# EasyEDA Pro project ProPrj_Microros_esp32_2025-06-17.epro, board PCB_V2.1
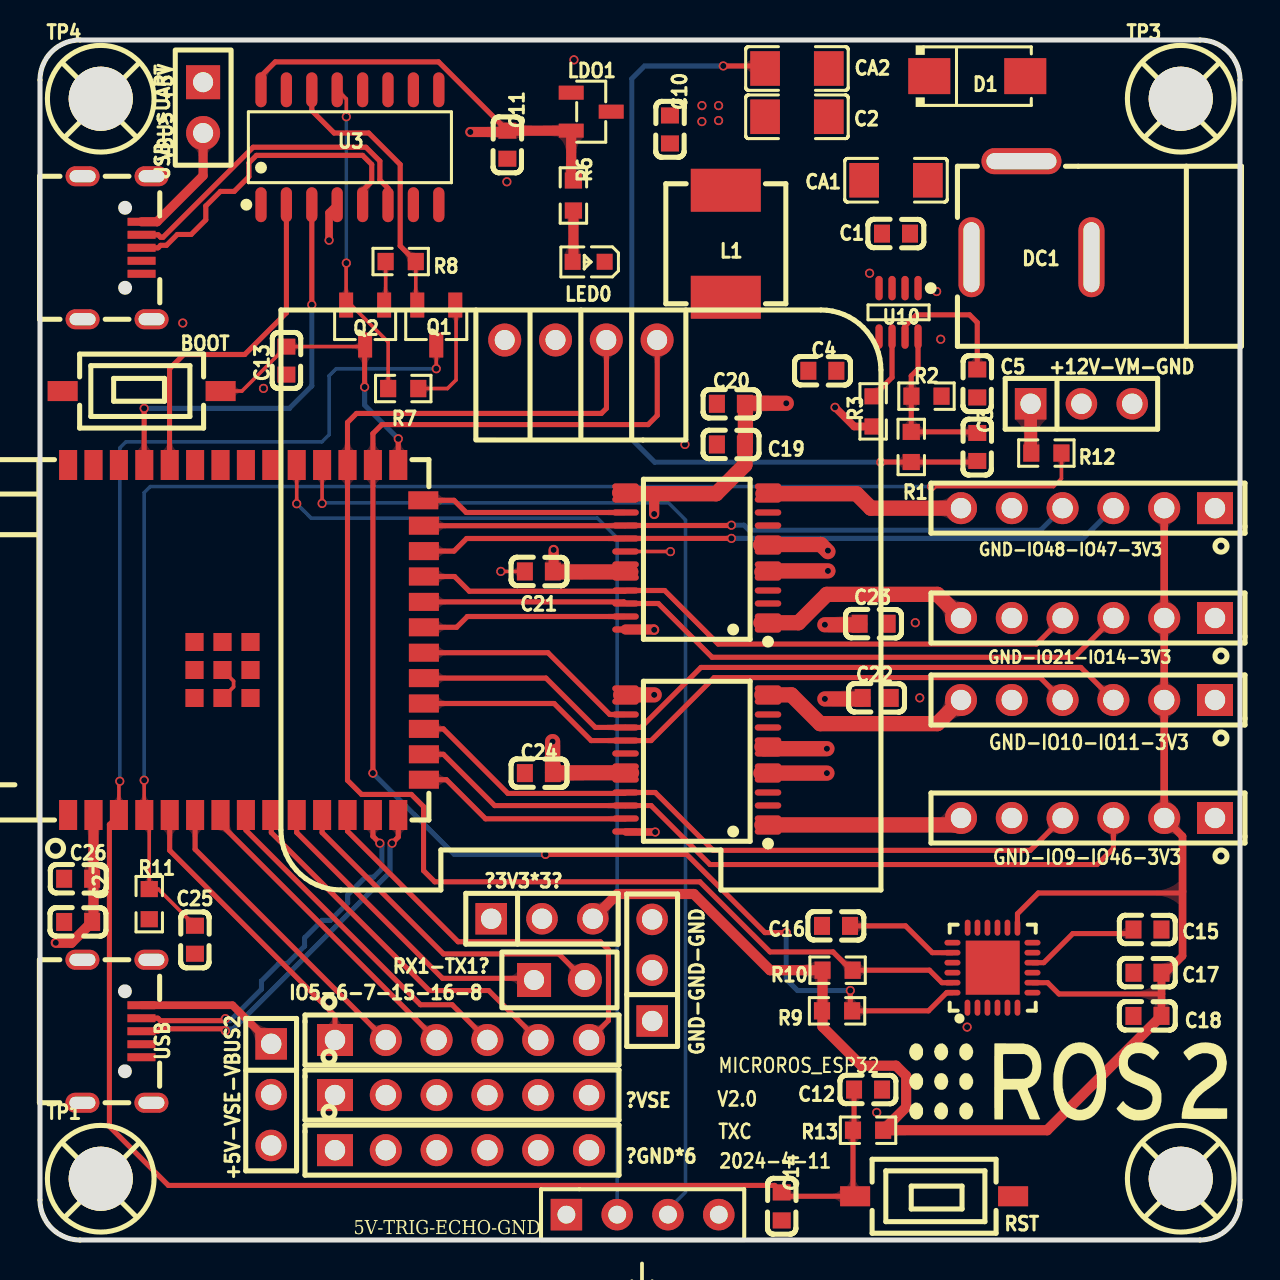
[diagram p10: board, top side]
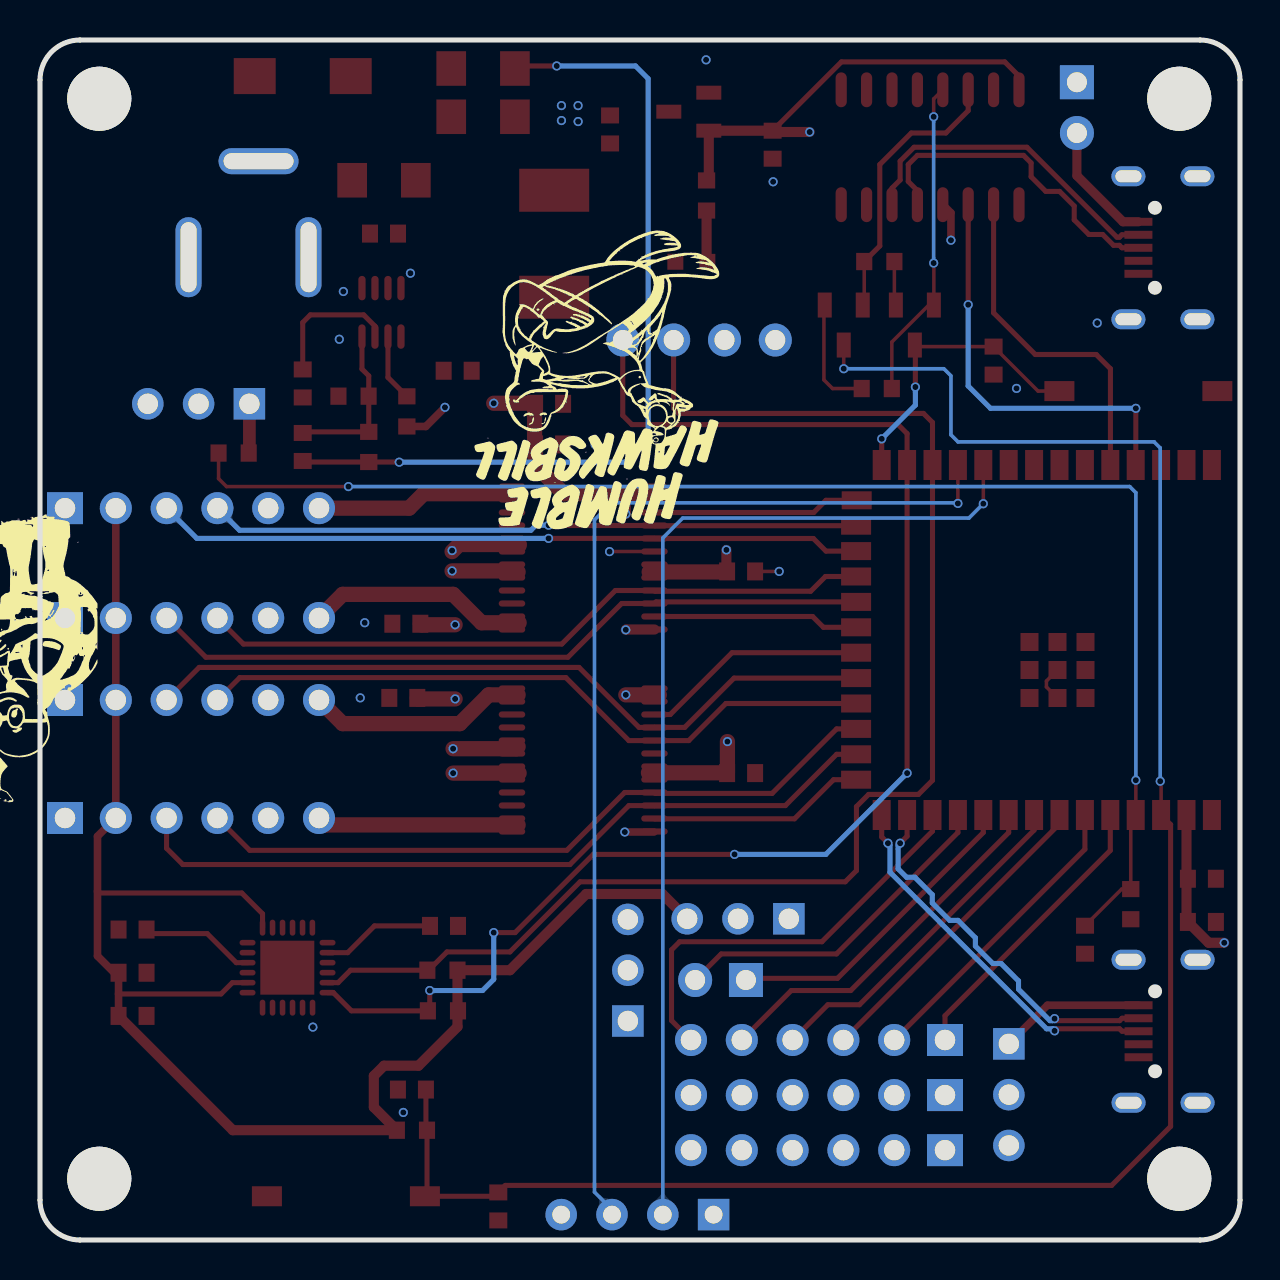
[diagram p11: board, bottom side, seen from below]

Outline 60 x 60 mm; copper layers: Top Layer, GND, POWER, Bottom Layer. Coordinates in mm from the lower left corner of the outline.
Outline path: 0,58 0,2 arc(0.59,0.59) 2,0 58,0 arc(59.41,0.59) 60,2 60,58 arc(59.41,59.41) 58,60 2,60 arc(0.59,59.41) 0,58
Stack: Top Layer 0.035mm 外层铜厚1oz / Dielectric1 0.2104mm 7628 RC49% 8.6mil / GND 0.0152mm 内层铜厚 / Dielectric2 1.065mm 1.1mm H/HOZ 含铜 / POWER 0.0152mm 内层铜厚 / Dielectric3 0.2104mm 7628 RC49% 8.6mil / Bottom Layer 0.035mm 外层铜厚1oz

## Design rules (mm)
net GPIO_19: DP2
net GPIO_20: DP2
net USB_DP: DP1
net USB_DN: DP1
template: 自定义配置
spacing copperThickness1oz (default): track to track 0.102, other pairs 0 to 0.3
spacing copperThickness2oz: track to track 0.203, other pairs 0.152 to 0.3
track width copperThickness1oz (default): min 0.127, default 0.178, max 2.54
track width copperThickness2oz: min 0.203, default 0.254, max 2.54
differential pair differentialPair (default): width min 0.254, default 0.254, max 0.254; gap min 0.152, default 0.152
via viaSize (default): diameter min 0.254, default 0.457, max 10; hole min 0.3, default 0.305, max 6.299

## Placement (name value [footprint] x y rotation side)
5V-TRIG-ECHO-GND  -  [HC-SR04]  30.1 1.24 0 top
+5V-VSE-VBUS2  -  [HDR-TH_3P-P2.54-V-F]  11.56 7.27 270 top
+12V-VM-GND  -  [HDR-TH_3P-P2.54-V-F]  52.07 41.81 0 top
BOOT  -  [Key_SMD_3.6x6.1x2.5]  5.08 42.45 0 top
C1  0.1uf  [C0603]  42.8 50.32 0 top
C2  22uf  [C1206]  37.85 56.16 180 top
C3  33PF  [C0603]  46.86 39.65 90 top
C4  0.1uf  [C0603]  39.12 43.46 180 top
C5  0.1uf  [C0603]  46.86 42.83 90 top
C10  1uf  [C0603]  31.5 55.53 270 top
C11  1uf  [C0603]  23.37 54.77 90 top
C12  1uf  [C0603]  41.4 7.52 0 top
C13  0.1uf  [C0603]  12.32 43.97 270 top
C14  0.1uf  [C0603]  37.09 1.68 270 top
C15  0.1uf  [C0603]  55.37 15.52 0 top
C16  2.2uf  [C0603]  39.8 15.7 0 top
C17  10nf  [C0603]  55.37 13.36 0 top
C18  0.1uf  [C0603]  55.37 11.2 0 top
C19  10uf  [C0603]  34.54 39.78 180 top
C20  0.1uf  [C0603]  34.54 41.81 180 top
C21  0.1uf  [C0603]  24.94 33.43 180 top
C22  10uf  [C0603]  41.84 27.1 0 top
C23  0.1uf  [C0603]  41.68 30.81 0 top
C24  0.1uf  [C0603]  24.94 23.34 180 top
C25  0.1uf  [C0603]  7.75 15.01 90 top
C26  22uF  [C0603]  1.91 18.06 180 top
C27  100nF  [C0603]  1.91 15.9 0 top
CA1  22uf  [C1206]  42.8 52.99 0 top
CA2  22uf  [C1206]  37.85 58.58 0 top
D1  SMAJ12A  [SMA_L4.3-W2.8-LS5.1-RD]  46.86 58.19 0 top
DC1  -  [DC-2.0]  49.7 48.87 0 top
GND-GND-GND  -  [HDR-TH_3P-P2.54-V-F]  30.61 13.49 90 top
GND-IO21-IO14-3V3  -  [HDR-TH_6P-P2.54-V-F]  52.4 31.1 180 top
GND-IO48-IO47-3V3  -  [HDR-TH_6P-P2.54-V-F]  52.4 36.59 180 top
H4  -  [HDR-TH_6P-P2.54-V-F]  52.4 21.1 180 top
H5  -  [HDR-TH_6P-P2.54-V-F]  52.4 27 180 top
IO5-6-7-15-16-8  -  [HDR-TH_6P-P2.54-V-F]  21.1 10 0 top
L1  4.7uH  [IND-SMD_L6.5-W6.0_GPSR0630]  34.29 49.81 90 top
LDO1  SC662K-3.3V  [SOT-23-3_L2.9-W1.3-P1.90-LS2.4-BR]  27.56 56.42 180 top
LED0  -  [LED_0603]  27.38 48.9 180 top
OLED1  0.96OLED_4P_MODULE_JX  [0.96OLED_4P]  27.05 45 0 top
Q1  L8050QLT1G  [SOT-23-3_L2.9-W1.3-P1.90-LS2.4-BR]  19.81 45.75 90 top
Q2  L8050QLT1G  [SOT-23-3_L2.9-W1.3-P1.90-LS2.4-BR]  16.26 45.75 90 top
R1  -  [R0603]  43.56 39.65 90 top
R2  -  [R0603]  44.32 42.19 0 top
R3  -  [R0603]  41.66 41.43 90 top
R6  -  [R0603]  26.67 52.22 270 top
R7  -  [R0603]  18.16 42.57 0 top
R8  -  [R0603]  18.03 48.92 180 top
R9  -  [R0603]  39.85 11.46 180 top
R10  -  [R0603]  39.88 13.49 180 top
R11  -  [R0603]  5.46 16.79 90 top
R12  -  [R0603]  50.32 39.35 180 top
R13  10kΩ  [R0603]  41.4 5.49 0 top
RST  -  [Key_SMD_3.6x6.1x2.5]  44.7 2.19 180 top
RX1-TX1👉  -  [HDR-TH_2P-P2.54-V-F]  25.97 13 0 top
TP1  -  [M3螺丝]  3.1 3 0 top
TP2  -  [M3螺丝]  57.1 3 0 top
TP3  -  [M3螺丝]  57.1 57 0 top
TP4  -  [M3螺丝]  3.1 57 0 top
U1  ESP32-S3-WROOM-1-N16R2  [WIRELM-SMD_ESP32-S3-WROOM-1]  10.3 30 90 top
U3  CH340C  [SOP-16_L10.0-W3.9-P1.27-LS6.0-BL]  15.5 54.64 0 top
U6  MPU-6050  [QFN-24_L4.0-W4.0-P0.50-BL-EP2.7]  47.62 13.62 0 top
U7  TB6612FNG,C,8,EL  [SSOP-24_L8.3-W5.6-P0.65-LS7.6-BL]  32.84 34.1 90 top
U8  TB6612FNG,C,8,EL  [SSOP-24_L8.3-W5.6-P0.65-LS7.6-BL]  32.84 24 90 top
U10  MP2225GJ-Z  [TSOT-23-8_L2.9-W1.6-P0.65-LS2.8-BR]  42.93 46.38 90 top
USB  -  [USB_Micro]  3.85 10.44 270 top
USB->UART  -  [USB_Micro]  3.85 49.61 270 top
VBUS +5V  -  [HDR-TH_2P-P2.54-V-F]  8.15 56.62 270 top
👇3V3*3👇  -  [HDR-TH_3P-P2.54-V-F]  25.1 16.06 0 top
👈GND*6  -  [HDR-TH_6P-P2.54-V-F]  21.1 4.49 0 top
👈VSE  -  [HDR-TH_6P-P2.54-V-F]  21.1 7.25 0 top

## Footprints (pads in the part's own frame, mm; a bottom-side part is the same pattern mirrored in y, then rotated)
0.96OLED_4P
  round 1.65 hole 1: 1(-3.81,-0.002) 2(-1.27,0.002) 3(1.27,0.002) 4(3.81,0.002)
C0603
  rect 0.8x0.9 smd: 1(-0.7,0) 2(0.7,0)
C1206
  rect 1.485x1.728 smd: 1(-1.593,0) 2(1.593,0)
DC-2.0
  oval 4x1.3 hole 3.5x0.8: 2(-0.627,5.067)
  oval 1.3x4 hole 0.8x3.5: 3(2.873,0.267) 4(-3.127,0.267)
HC-SR04
  rect 1.575x1.575 hole 0.889: 1(-3.78,0.03)
  round 1.575 hole 0.889: 2(-1.24,0.03) 3(1.3,0.03) 4(3.84,0.03)
HDR-TH_2P-P2.54-V-F
  rect 1.7x1.7 hole 1: 1(-1.27,0)
  round 1.7 hole 1: 2(1.27,0)
HDR-TH_3P-P2.54-V-F
  rect 1.575x1.575 hole 1.02: 1(-2.54,0)
  round 1.575 hole 1.02: 2(0,0) 3(2.54,0)
HDR-TH_6P-P2.54-V-F
  rect 1.8x1.6 hole 1.02: 1(-6.35,0)
  round 1.6 hole 1.02: 2(-3.81,0) 3(-1.27,0) 4(1.27,0) 5(3.81,0) 6(6.35,0)
IND-SMD_L6.5-W6.0_GPSR0630
  rect 2.15x3.5 smd: 1(-2.675,0) 2(2.675,0)
Key_SMD_3.6x6.1x2.5
  rect 1.501x1.001 smd: 1(-3.95,0) 2(3.95,0)
LED_0603
  rect 0.8x0.8 smd: 1(-0.851,-0.01) 2(0.75,-0.005)
M3螺丝
  round 3.2 hole 3.2: 1(-0.064,0.064)
QFN-24_L4.0-W4.0-P0.50-BL-EP2.7
  oval 0.28x0.8 smd: 1(-1.25,-2) 2(-0.75,-2) 3(-0.25,-2) 4(0.25,-2) 5(0.75,-2) 6(1.25,-2) 13(1.25,2) 14(0.75,2) 15(0.25,2) 16(-0.25,2) 17(-0.75,2) 18(-1.242,2)
  oval 0.8x0.28 smd: 7(2,-1.25) 8(2,-0.75) 9(2,-0.25) 10(2,0.25) 11(2,0.75) 12(2,1.25) 19(-2,1.25) 20(-2,0.75) 21(-2,0.25) 22(-2,-0.25) 23(-2,-0.75) 24(-2,-1.25)
  rect 2.7x2.7 smd: 25(0.013,0)
R0603
  rect 0.806x0.864 smd: 1(-0.753,0) 2(0.753,0)
SMA_L4.3-W2.8-LS5.1-RD
  rect 2.1x1.8 smd: 1(-2.4,0) 2(2.4,0)
SOP-16_L10.0-W3.9-P1.27-LS6.0-BL
  oval 0.56x1.745 smd: 1(-4.445,-2.873) 2(-3.175,-2.873) 3(-1.905,-2.873) 4(-0.635,-2.873) 5(0.635,-2.873) 6(1.905,-2.873) 7(3.175,-2.873) 8(4.445,-2.873) 9(4.445,2.873) 10(3.175,2.873) 11(1.905,2.873) 12(0.635,2.873) 13(-0.635,2.873) 14(-1.905,2.873) 15(-3.175,2.873) 16(-4.445,2.873)
SOT-23-3_L2.9-W1.3-P1.90-LS2.4-BR
  rect 1.25x0.7 smd: 1(1,-0.95) 2(1,0.95) 3(-1,0)
SSOP-24_L8.3-W5.6-P0.65-LS7.6-BL
  oval 0.308x1.324 smd: 1(-3.575,-3.562) 2(-2.925,-3.562) 3(-2.275,-3.562) 4(-1.625,-3.562) 5(-0.975,-3.562) 6(-0.325,-3.562) 7(0.325,-3.562) 8(0.975,-3.562) 9(1.625,-3.562) 10(2.275,-3.562) 11(2.925,-3.562) 12(3.575,-3.562) 13(3.575,3.562) 14(2.925,3.562) 15(2.275,3.562) 16(1.625,3.562) 17(0.975,3.562) 18(0.325,3.562) 19(-0.325,3.562) 20(-0.975,3.562) 21(-1.625,3.562) 22(-2.275,3.562) 23(-2.925,3.562) 24(-3.575,3.562)
TSOT-23-8_L2.9-W1.6-P0.65-LS2.8-BR
  oval 1.222x0.364 smd: 1(1.211,-0.975) 2(1.211,-0.325) 3(1.211,0.325) 4(1.211,0.975) 5(-1.211,0.975) 6(-1.211,0.325) 7(-1.211,-0.325) 8(-1.211,-0.975)
USB_Micro
  rect 0.4x1.4 smd: 1(-1.3,1.225) 2(-0.65,1.225) 3(0,1.225) 4(0.65,1.225) 5(1.3,1.225)
  oval 1x1.7 hole 0.6x1.3: 6(-3.575,1.725) 6(-3.575,-1.725) 6(3.575,1.725) 6(3.575,-1.725)
WIRELM-SMD_ESP32-S3-WROOM-1
  rect 1.5x0.9 smd: 1(-8.75,8.895) 2(-8.75,7.625) 3(-8.75,6.355) 4(-8.75,5.085) 5(-8.75,3.815) 6(-8.75,2.545) 7(-8.75,1.275) 8(-8.75,0.005) 9(-8.75,-1.265) 10(-8.75,-2.535) 11(-8.75,-3.805) 12(-8.75,-5.075) 13(-8.75,-6.345) 14(-8.75,-7.615) 27(8.75,-7.615) 28(8.75,-6.345) 29(8.75,-5.075) 30(8.75,-3.805) 31(8.75,-2.535) 32(8.75,-1.265) 33(8.75,0.005) 34(8.75,1.275) 35(8.75,2.545) 36(8.75,3.815) 37(8.75,5.085) 38(8.75,6.355) 39(8.75,7.625) 40(8.75,8.895)
  rect 0.9x1.5 smd: 15(-6.985,-8.895) 16(-5.715,-8.895) 17(-4.445,-8.895) 18(-3.175,-8.895) 19(-1.905,-8.895) 20(-0.635,-8.895) 21(0.635,-8.895) 22(1.905,-8.895) 23(3.175,-8.895) 24(4.445,-8.895) 25(5.715,-8.895) 26(6.985,-8.865)
  rect 0.9x0.9 smd: 41(-2.9,2.575) 41(-2.9,1.175) 41(-2.9,-0.225) 41(-1.5,2.575) 41(-1.5,1.175) 41(-1.5,-0.225) 41(-0.1,2.575) 41(-0.1,1.175) 41(-0.1,-0.225)

## Nets
+5V: 5V-TRIG-ECHO-GND.1 +5V-VSE-VBUS2.3 C2.2 C3.1 C10.1 C21.1 C24.1 CA2.1 L1.2 LDO1.3 OLED1.2 R1.1 U7.19 U7.20 U8.19 U8.20 VBUS +5V.1
+12V: +12V-VM-GND.1 C1.2 CA1.2 D1.1 DC1.4 R3.1 R12.2 U10.2
GND: 5V-TRIG-ECHO-GND.4 +12V-VM-GND.3 BOOT.1 C1.1 C2.1 C5.1 C10.2 C11.1 C12.2 C13.2 C14.2 C15.2 C16.1 C17.1 C18.1 C19.2 C20.2 C21.2 C22.2 C23.2 C24.2 C25.1 C26.2 C27.1 CA1.1 CA2.2 D1.2 DC1.2 DC1.3 GND-GND-GND.1 GND-GND-GND.2 GND-GND-GND.3 GND-IO21-IO14-3V3.5 GND-IO48-IO47-3V3.5 H4.5 H5.5 LDO1.1 LED0.1 OLED1.1 R2.2 R11.1 RST.1 U1.1 U1.40 U1.41 U3.1 U6.1 U6.9 U6.11 U6.18 U6.25 U7.3 U7.4 U7.9 U7.10 U7.18 U8.3 U8.4 U8.9 U8.10 U8.18 U10.1 U10.4 USB.5 USB.6 USB->UART.5 USB->UART.6 👈GND*6.1 👈GND*6.2 👈GND*6.3 👈GND*6.4 👈GND*6.5 👈GND*6.6
VBUS1: USB->UART.1 VBUS +5V.2
VBUS2: +5V-VSE-VBUS2.1 USB.1
VCC_3V3: C11.2 C17.2 C18.2 C26.1 C27.2 GND-IO21-IO14-3V3.2 GND-IO48-IO47-3V3.2 H4.2 H5.2 LDO1.2 R6.1 R9.2 R10.2 R13.2 U1.2 U3.4 U3.16 U6.8 U6.13 👇3V3*3👇.1 👇3V3*3👇.2 👇3V3*3👇.3
ADC: C25.2 R11.2 R12.1 U1.4
DTR: Q2.2 R7.1 U3.13
ECHO: 5V-TRIG-ECHO-GND.3 U1.30
ESP_RST: C12.1 C14.1 Q1.3 R13.1 RST.2 U1.3
ESP_RX: U1.36 U3.2
ESP_TX: U1.37 U3.3
GPIO_0: BOOT.2 C13.1 Q2.3 U1.27
GPIO_3: U1.15 U8.23
GPIO_5: IO5-6-7-15-16-8.1 U1.5
GPIO_6: IO5-6-7-15-16-8.2 U1.6
GPIO_7: IO5-6-7-15-16-8.3 U1.7
GPIO_8: IO5-6-7-15-16-8.6 U1.12
GPIO_9: H4.4 U1.17 U8.21
GPIO_10: H5.4 U1.18 U8.17
GPIO_11: H5.3 U1.19 U8.16
GPIO_12: U1.20 U8.15
GPIO_13: U1.21 U7.23
GPIO_14: GND-IO21-IO14-3V3.3 U1.22 U7.22
GPIO_15: IO5-6-7-15-16-8.4 U1.8
GPIO_16: IO5-6-7-15-16-8.5 U1.9
GPIO_19: U1.13 USB.2
GPIO_20: U1.14 USB.3
GPIO_21: GND-IO21-IO14-3V3.4 U1.23 U7.21
GPIO_35: OLED1.4 R9.1 U1.28 U6.24
GPIO_36: OLED1.3 R10.1 U1.29 U6.23
GPIO_38: 5V-TRIG-ECHO-GND.2 U1.31
GPIO_45: U1.26 U7.15
GPIO_46: H4.3 U1.16 U8.22
GPIO_47: GND-IO48-IO47-3V3.3 U1.24 U7.17
GPIO_48: GND-IO48-IO47-3V3.4 U1.25 U7.16
M1_AO1: GND-IO21-IO14-3V3.6 U7.1 U7.2
M1_AO2: GND-IO21-IO14-3V3.1 U7.5 U7.6
M1_BO1: GND-IO48-IO47-3V3.6 U7.11 U7.12
M1_BO2: GND-IO48-IO47-3V3.1 U7.7 U7.8
M2_AO1: H4.6 U8.1 U8.2
M2_AO2: H4.1 U8.5 U8.6
M2_BO1: H5.6 U8.11 U8.12
M2_BO2: H5.1 U8.7 U8.8
RTS: Q1.2 R8.1 U3.14
RX1: RX1-TX1👉.1 U1.10
TX1: RX1-TX1👉.2 U1.11
USB_DN: U3.6 USB->UART.2
USB_DP: U3.5 USB->UART.3
VMOTOR: +12V-VM-GND.2 C19.1 C20.1 C22.1 C23.1 U7.13 U7.14 U7.24 U8.13 U8.14 U8.24
VSERVO: +5V-VSE-VBUS2.2 👈VSE.1 👈VSE.2 👈VSE.3 👈VSE.4 👈VSE.5 👈VSE.6
$1N8417: LED0.2 R6.2
$1N8423: Q1.1 R7.2
$1N8428: Q2.1 R8.2
$1N8498: C15.1 U6.10
$1N8500: C16.2 U6.20
$1N8840: C5.2 U10.7
$1N8848: R3.2 U10.6
$1N8850: C4.2 L1.1 U10.3
$1N8851: C4.1 U10.5
$1N8854: C3.2 R1.2 R2.1 U10.8

Pads without a net: TP1 1; TP2 1; TP3 1; TP4 1; U1 32 33 34 35 38 39; U3 7 8 9 10 11 12 15; U6 2 3 4 5 6 7 12 14 15 16 17 19 21 22; USB 4; USB->UART 4

## Via types
v1: diameter 0.457, hole 0.305, Top Layer to Bottom Layer, 59 vias

## Routing (per net, layer and track width the routed paths; a pad name or vN(x,y) marks a point on that pad's centre or on a via; arc(x,y) is an arc through that point)
+5V: length 172.6
  Top Layer w0.254: v1(42.04,38.89) 42.05,38.9 R1.1 46.81,38.9 C3.1 ; v1(34.16,58.7) 36.13,58.7 CA2.1
  Top Layer w0.508: v1(25.68,34.5) 25.68,33.47 C21.1
  Top Layer w0.635: 25.63,23.36 C24.1
  Top Layer w0.762: 29.58,23.36 25.63,23.36 v1(25.63,24.92) ; 29.54,33.4 25.74,33.4 25.68,33.47
  POWER w0.508: 27.41,24.92 27.4,24.92 v1(25.63,24.92) ; 5V-TRIG-ECHO-GND.1 12.4,1.27 11.51,2.16 11.51,4.68 +5V-VSE-VBUS2.3 ; 27.41,34.5 v1(25.68,34.5)
  POWER w1.27: 5V-TRIG-ECHO-GND.1 26.32,1.73 27.38,2.79 30.93,2.79 32.94,4.8 32.94,17.27 31.74,18.47 28.78,18.47 27.41,19.84 27.41,43.37 OLED1.2 25.78,54.58 27.46,56.26 33.86,56.26 32.23,57.89 VBUS +5V.1
  Bottom Layer w0.254: v1(34.16,58.7) 30.23,58.7 29.59,58.07 29.59,40.03 30.73,38.89 v1(42.04,38.89)
  vias: v1(33.1,56.72) v1(33.09,55.92) v1(33.93,56.72) v1(33.93,55.97)
+12V: length 14.6
  Top Layer w0.381: R3.1 40.71,40.68 v1(39.75,41.63)
  Top Layer w0.635: +12V-VM-GND.1 49.53,39.38 R12.2
  POWER w0.381: +12V-VM-GND.1 49.35,41.63 v1(39.75,41.63)
GND: length 14.6
  Top Layer w0.178: U7.18 31.52,34.42 v1(31.52,34.42) ; C21.2 v1(23.04,33.43) ; U1.41 9.68,27.65 9.68,27.95 U1.41
  GND w0.178: v1(23.04,33.43) 31.14,33.43 31.57,33.86 31.57,34.37 v1(31.52,34.42)
  vias: v1(7.14,45.85) v1(11.17,42.58) v1(23.34,52.91) v1(26.7,59.01) v1(32.25,39.78) v1(41.48,48.34) v1(41.84,6.38) v1(43.76,30.86) v1(43.99,27.11) v1(44.83,47.42) v1(45.03,45.04) v1(46.36,10.65)
VBUS1: length 6.2
  Top Layer w0.457: USB->UART.1 5.85,50.91 8.15,53.22 VBUS +5V.2
VBUS2: length 7.3
  Top Layer w0.381: +5V-VSE-VBUS2.1 9.63,11.74 5.07,11.74
VCC_3V3: length 193.2
  Top Layer w0.254: U3.16 11.05,58.19 11.76,58.91 19.93,58.91 C11.2 ; 57.13,17.43 57.04,17.35 49.91,17.35 48.87,16.31 U6.13 ; U6.8 50.38,12.87 50.95,12.3 56.07,12.3
  Top Layer w0.381: v1(14.45,49.99) 14.45,51.36 U3.4 ; GND-IO48-IO47-3V3.2 GND-IO21-IO14-3V3.2 H5.2 H4.2 57.13,20.18 57.13,14.2 56.29,13.36 C17.2 C18.2
  Top Layer w0.508: 👇3V3*3👇.3 28.88,17.3 32.69,17.3 36.5,13.49 R10.2 39.13,10.66 41.07,8.72 42.8,8.72 43.31,8.21 43.31,6.64 R13.2 50.36,5.49 C18.2 ; R6.1 26.56,53.09 LDO1.2 ; v1(0.79,14.86) 1.56,14.86 C27.2 2.67,15.97 2.67,21.25 ; 26.56,55.47 C11.2 23.3,55.4 v1(21.51,55.4)
  POWER w0.381: 21.51,49.99 v1(14.45,49.99)
  POWER w0.508: 👇3V3*3👇.1 11.59,16.06 6.99,11.46 2.87,11.46 0.79,13.54 v1(0.79,14.86) ; 👇3V3*3👇.1 👇3V3*3👇.2 👇3V3*3👇.3 ; 👇3V3*3👇.1 21.51,17.11 v1(21.51,55.4)
ADC: length 70.4
  Top Layer w0.178: C25.2 5.92,17.55 R11.2 5.46,21 U1.4 5.21,21.26 v1(5.21,22.99) ; v1(44.58,37.67) 50.67,37.67 51.07,38.07 R12.1
  Bottom Layer w0.178: v1(44.58,37.67) 5.51,37.67 5.21,37.37 v1(5.21,22.99)
DTR: length 16.1
  Top Layer w0.178: v1(15.32,56.16) 15.32,57.05 U3.13 ; v1(15.32,48.85) 15.31,48.84 Q2.2 15.56,46.75 17.41,44.9 R7.1
  Bottom Layer w0.178: v1(15.32,48.85) v1(15.32,56.16)
ECHO: length 55.3
  Top Layer w0.178: 14.1,36.81 14.1,36.81 U1.30
  Bottom Layer w0.178: v1(14.1,36.83) 14.13,36.86 31.42,36.86 32.28,36 32.28,2.4 31.4,1.52
ESP_RST: length 98.6
  Top Layer w0.178: U1.3 3.94,22.89 v1(3.99,22.94) ; Q1.3 v1(19.81,43.56)
  Top Layer w0.254: C12.1 40.7,5.54 R13.1 40.65,2.29 RST.2 37.28,2.19 C14.1 36.73,2.73 6.42,2.73 3.47,5.68 3.47,20.77 U1.3
  Bottom Layer w0.178: v1(19.81,43.56) 14.81,43.56 14.45,43.21 14.45,40.26 14.1,39.91 4.29,39.91 3.99,39.6 v1(3.99,22.94)
ESP_RX: length 17.2
  Top Layer w0.254: U1.36 6.48,38.76 6.48,43.56 7.19,44.28 10.24,44.28 12.32,46.36 U3.2
ESP_TX: length 20.7
  Top Layer w0.254: U3.3 v1(13.59,46.76) ; U1.37 5.21,38.76 v1(5.21,41.58)
  Bottom Layer w0.254: v1(13.59,46.76) 13.59,42.7 12.47,41.58 v1(5.21,41.58)
GPIO_0: length 14.8
  Top Layer w0.178: BOOT.2 10.1,42.45 C13.1 16.18,44.67 16.23,44.72
  Top Layer w0.254: U1.27 v1(17.91,40.06) ; v1(16.23,42.65) 16.23,44.72 Q2.3
  Bottom Layer w0.254: v1(16.23,42.65) 16.23,41.74 v1(17.91,40.06)
GPIO_3: length 10.9
  Top Layer w0.254: U1.15 20.32,23.02 22.28,21.06 29.26,21.06 U8.23
GPIO_5: length 14.7
  Top Layer w0.254: U1.5 6.48,19.48 14.75,11.21 IO5-6-7-15-16-8.1
GPIO_6: length 15.2
  Top Layer w0.254: 7.75,21.25 7.75,19.53 IO5-6-7-15-16-8.2
GPIO_7: length 15.7
  Top Layer w0.254: 9.03,21.25 9.03,20.81 IO5-6-7-15-16-8.3
GPIO_8: length 21.2
  Top Layer w0.254: 15.38,21.25 15.38,20.44 20.91,14.91 28.02,14.91 28.42,14.51 28.42,10.97 IO5-6-7-15-16-8.6
GPIO_9: length 35.2
  Top Layer w0.254: H4.4 49.51,19.48 33.66,19.48 30.77,22.38 U8.21 29.23,22.33 23.39,22.33 20.17,25.56 U1.17
GPIO_10: length 34.5
  Top Layer w0.254: U1.18 25.71,26.83 27.56,24.97 29.27,24.97 ; 29.27,24.97 U8.17 ; 29.27,24.97 30.56,24.97 33.71,28.12 50.01,28.12 H5.4
GPIO_11: length 37.4
  Top Layer w0.254: 29.27,25.63 U8.16 ; 29.27,25.63 27.76,25.63 25.3,28.09 U1.19 ; 29.27,25.63 30.05,25.63 33.05,28.63 52.04,28.63 H5.3
GPIO_12: length 11.4
  Top Layer w0.254: U8.15 28.49,26.28 25.4,29.36 U1.20
GPIO_13: length 10.3
  Top Layer w0.254: U7.23 21.37,31.17 20.83,30.64 U1.21
GPIO_14: length 36.4
  Top Layer w0.254: U1.22 29.2,31.91 U7.22 30.92,31.83 33.6,29.14 51.71,29.14 GND-IO21-IO14-3V3.3
GPIO_15: length 17.2
  Top Layer w0.254: IO5-6-7-15-16-8.4 20.61,11.76 19.03,11.76 10.29,20.49 U1.8
GPIO_16: length 18.5
  Top Layer w0.254: IO5-6-7-15-16-8.5 22.44,12.47 19.46,12.47 11.56,20.37 U1.9
GPIO_19: length 18.9
  Top Layer w0.254: 5.07,11.09 5.9,11.09 6.02,10.97 9.17,10.97 v1(9.27,11.07) ; v1(16.99,19.84) 16.64,20.19 U1.13
  Bottom Layer w0.254: v1(16.99,19.84) 17.09,19.74 17.09,18.56 16.67,18.14 16.25,18.14 15.38,17.27 15.38,16.85 14.51,15.98 14.1,15.98 13.23,15.11 13.23,14.69 12.36,13.83 11.94,13.83 11.07,12.95 11.07,12.54 9.5,10.97 9.37,10.97 v1(9.27,11.07)
GPIO_20: length 18.8
  Top Layer w0.254: v1(17.6,19.84) 17.91,20.15 U1.14 ; 5.07,10.44 5.9,10.44 6.02,10.56 9.17,10.56 v1(9.27,10.46)
  Bottom Layer w0.254: v1(17.6,19.84) 17.5,19.74 17.5,18.39 9.67,10.56 9.37,10.56 v1(9.27,10.46)
GPIO_21: length 33.9
  Top Layer w0.254: U1.23 20.73,33.17 21.46,32.44 29.24,32.44 U7.21 31.23,32.47 33.91,29.8 49.83,29.8 GND-IO21-IO14-3V3.4
GPIO_35: length 71.6
  Top Layer w0.254: v1(37.31,15.37) 36.25,15.37 32.34,19.28 v1(25.27,19.28) ; R9.1 40.51,11.46 ; R9.1 40.51,11.55 v1(40.51,12.47) ; R9.1 44.43,11.46 45.33,12.37 U6.24 ; OLED1.4 30.86,45 30.86,41.23 30.41,40.77 17.09,40.77 16.64,40.32 U1.28 v1(16.64,23.34)
  Bottom Layer w0.254: v1(16.64,23.34) 20.71,19.28 v1(25.27,19.28) ; v1(40.51,12.47) 37.87,12.47 37.31,13.03 v1(37.31,15.37)
GPIO_36: length 70.9
  Top Layer w0.254: U6.23 45.1,12.87 44.47,13.49 R10.1 40.56,13.49 39.65,14.4 36.5,14.4 33,17.91 19.74,17.91 19.18,18.47 19.18,21.67 18.57,22.28 16.08,22.28 15.38,22.98 15.38,40.88 15.82,41.33 28.07,41.33 28.32,41.58 28.32,45 OLED1.3
GPIO_38: length 52.3
  Top Layer w0.178: 12.84,38.75 v1(12.84,36.81) 12.83,36.81
  Bottom Layer w0.178: v1(12.84,36.81) 13.55,36.1 27.86,36.1 28.86,35.1 28.86,1.52
GPIO_45: length 10.4
  Top Layer w0.254: U1.26 20.7,36.98 21.31,36.38 U7.15
GPIO_46: length 38.6
  Top Layer w0.254: 29.27,21.72 U8.22 ; 29.27,21.72 30.56,21.72 33.5,18.77 52.86,18.77 53.67,19.59 53.67,21.1 ; 29.27,21.72 22.73,21.72 20.17,24.28 U1.16
GPIO_47: length 35.4
  Top Layer w0.254: v1(34.57,35.08) 29.28,35.08 29.28,35.08 21.33,35.08 20.7,34.44 U1.24
  Bottom Layer w0.254: v1(34.57,35.08) 52.16,35.08 GND-IO48-IO47-3V3.3
GPIO_48: length 32.5
  Top Layer w0.254: 29.33,35.72 34.56,35.72 v1(34.57,35.74) ; U1.25 29.27,35.72 U7.16
  Bottom Layer w0.254: GND-IO48-IO47-3V3.4 50.02,35.49 35.45,35.49 35.2,35.74 v1(34.57,35.74)
M1_AO1: length 11.1
  Top Layer w0.762: GND-IO21-IO14-3V3.6 44.87,32.28 39.34,32.28 37.92,30.86 36.04,30.86
M1_AO2: length 23.7
  Top Layer w0.762: 36.09,33.4 36.14,33.45 v1(39.4,33.45)
  POWER w0.762: v1(39.4,33.45) 56.4,33.45 GND-IO21-IO14-3V3.1
M1_BO1: length 10.2
  Top Layer w0.762: 36.14,37.31 40.82,37.31 41.54,36.59 GND-IO48-IO47-3V3.6
M1_BO2: length 23.8
  Top Layer w0.762: 36.04,34.72 36.04,34.78 39.04,34.78 39.4,34.42
  POWER w0.762: v1(39.4,34.47) 56.63,34.47 GND-IO48-IO47-3V3.1
M2_AO1: length 10.1
  Top Layer w0.762: H4.6 45.7,20.75 36.09,20.75
M2_AO2: length 23.6
  Top Layer w0.762: v1(39.35,23.34) 36.04,23.34
  POWER w0.762: v1(39.35,23.34) 56.5,23.34 H4.1
M2_BO1: length 11
  Top Layer w0.762: H5.6 44.87,25.82 39.01,25.82 37.57,27.26 36.09,27.26
M2_BO2: length 23.7
  Top Layer w0.762: v1(39.35,24.56) 36.2,24.56 36.09,24.67
  POWER w0.762: H5.1 56.31,24.56 v1(39.35,24.56)
RTS: length 14
  Top Layer w0.178: Q1.2 18.79,46.82 R8.1
  Top Layer w0.254: R8.1 18.01,49.7 18.01,53.77 16.44,55.35 14.71,55.35 13.59,56.47 U3.14
RX1: length 15.8
  Top Layer w0.254: 12.84,21.25 12.84,20.37 20.12,13.08 24.62,13.08 24.7,13
TX1: length 17.1
  Top Layer w0.254: U1.11 14.1,20.37 20.17,14.3 25.94,14.3 RX1-TX1👉.2
USB_DN: length 16.5
  Top Layer w0.254: U3.6 17.4,52.59 16.99,53 16.99,53.94 16.3,54.64 10.65,54.64 6.16,50.14 6.03,50.14 5.91,50.26 5.08,50.26
USB_DP: length 16.6
  Top Layer w0.254: USB->UART.3 5.91,49.61 6.03,49.73 6.32,49.73 6.87,50.28 7.56,50.28 8.29,51.01 8.29,51.7 9.02,52.43 9.71,52.43 10.44,53.16 10.44,53.85 10.82,54.23 16.13,54.23 16.59,53.77 16.59,52.93 16.13,52.47 U3.5
VMOTOR: length 84.3
  Top Layer w0.381: v1(30.76,20.4) 29.3,20.4
  Top Layer w0.508: U7.24 30.69,30.53 v1(30.71,30.51) ; v1(30.71,36.3) 30.71,37.29 30.68,37.31
  Top Layer w0.762: v1(39.24,30.76) 40.93,30.76 C23.1 ; C22.1 41.08,27.05 v1(39.24,27.05) ; v1(37.31,41.84) 35.27,41.84 ; 35.27,41.84 35.27,39.8 C19.1 35.25,38.75 33.81,37.31 29.03,37.31 28.98,37.37 ; 35.27,41.84 C20.1 ; v1(30.71,27.26) 29.03,27.26
  POWER w0.508: v1(30.71,30.51) v1(30.71,36.3)
  POWER w0.762: v1(37.31,41.84) 37.31,40.04 37.23,39.96 ; 33,24.36 30.76,22.13 v1(30.76,20.4) ; 33,24.36 36.55,24.36 v1(39.24,27.05) v1(39.24,30.76) 39.22,30.78 33,30.78 ; 33,24.36 30.71,26.65 v1(30.71,27.26)
  POWER w1.27: +12V-VM-GND.2 52.07,40.39 51.64,39.96 34.01,39.96 33,38.94 33,30.78
VSERVO: length 15.9
  POWER w0.508: +5V-VSE-VBUS2.2 27.43,7.27 👈VSE.6
$1N8417: length 2.6
  Top Layer w0.508: R6.2 26.67,48.95 LED0.2
$1N8423: length 5.8
  Top Layer w0.178: R7.2 20.37,42.57 20.8,43 20.8,46.71 20.76,46.75
$1N8428: length 2.2
  Top Layer w0.178: R8.2 17.28,46.82 Q2.1
$1N8498: length 5.7
  Top Layer w0.254: C15.1 54.47,15.32 51.64,15.32 50.19,13.87 U6.10
$1N8500: length 5.7
  Top Layer w0.254: U6.20 44.62,14.37 43.28,15.7 C16.2
$1N8840: length 6.9
  Top Layer w0.254: U10.7 43.25,45.69 43.82,46.26 46.48,46.26 46.86,45.88 C5.2
$1N8848: length 3.4
  Top Layer w0.254: R3.2 42.6,43.13 U10.6
$1N8854: length 8.2
  Top Layer w0.254: U10.8 43.9,43.55 43.56,43.21 43.56,42.2 ; 43.56,42.2 R2.1 ; 43.56,42.2 R1.2 46.81,40.41 C3.2

## Copper pours and planes (outline as drawn; the poured copper is in the pictures)
+5V on Top Layer: 32.26,50.32 37.59,50.32 37.59,59.46 37.47,59.59 27.57,59.59 27.57,55.54 27.56,55.53 32.3,55.53 32.3,50.36
+12V on Top Layer: 43.08,46.95 43.08,59.59 46.03,59.59 46.03,52.38 50.8,52.38 50.8,40.67 50.67,40.54 48.26,40.54 48.26,46.79 45.87,46.79 45.87,48.54 43.75,48.54 43.44,48.03 43.44,46.95
GND on Top Layer: -8.81,65.41 66.27,65.41 66.27,-3.63 -8.81,-3.63
GND on Top Layer: 6.86,30.35 11,30.35 11,26.44 6.86,26.44
GND on Top Layer: 46.32,59.59 46.32,53.24 51.18,53.24 51.31,53.11 51.31,44.73 51.44,44.61 53.34,44.61 53.34,40.51 56.26,40.51 56.26,55.15 54.99,55.15 54.99,59.59
GND on Top Layer: 42.15,47.14 41.77,47.14 41.77,47.16 37.97,50.95 37.97,59.7 42.69,59.7 42.8,59.59 42.8,49.43 42.15,49.43
GND on Bottom Layer: -8.46,65.71 65.97,65.71 65.97,-3.17 -8.46,-3.17
GND on GND: -8.33,65.61 65.71,65.61 65.71,-3.43 -8.33,-3.43
GND on POWER: -7.8,65.61 65.86,65.61 65.86,-3.43 -7.8,-3.43
$1N8850 on Top Layer: 32.28,49.81 32.28,42.95 39.12,42.95 39.12,46.12 42.54,46.12 42.8,46.38 42.8,48.24 42.41,48.24 42.41,47.14 42.04,46.76 41.53,46.76 38.48,49.81
$1N8851 on Top Layer: 39.34,45.84 39.37,45.88 42.16,45.88 42.16,43.2 40.26,43.2 40.26,43.21 40.26,42.98 39.34,42.98

Small or netless copper shapes (teardrops, artwork), in the pictures only: 203 on Top Layer, 28 on Bottom Layer, 2 on GND, 41 on POWER

## Text on the board
Top Silkscreen Layer: MICROROS_ESP32 | V2.0 | TXC | 2024-4-11 | GND-IO10-IO11-3V3 | GND-IO9-IO46-3V3
